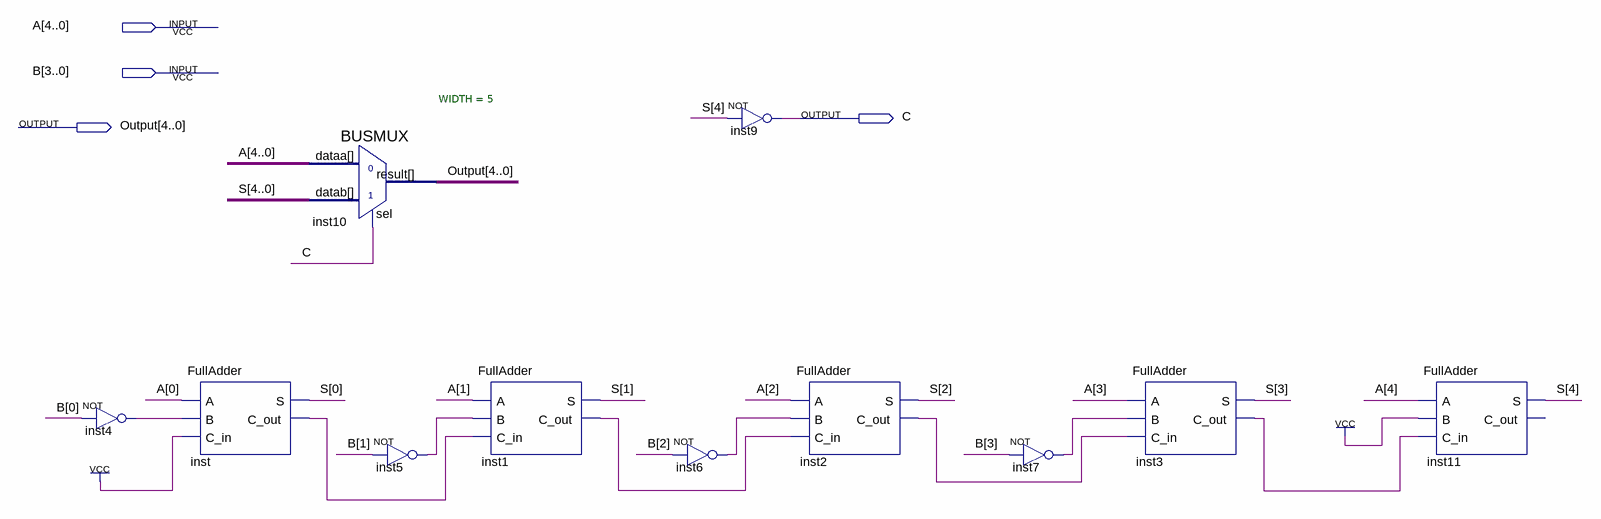
[diagram p0: schematic sheet]
// Quartus schematic Subtractor4_bit.bdf as structural Verilog: 11 symbols, 4 pins
module Subtractor4_bit (
  input  [4:0] A,
  input  [3:0] B,
  output C,
  output [4:0] Output
);

  wire inst1_c_out, inst2_c_out, inst3_c_out, inst4_out, inst5_out, inst6_out, inst7_out, inst_c_out;
  wire [4:0] S;

  not inst4 (inst4_out, B[0]);
  FullAdder inst (.A(A[0]), .B(inst4_out), .C_in(1'b1), .S(S[0]), .C_out(inst_c_out));
  BUSMUX #(.WIDTH(5)) inst10 (.datab(S), .sel(C), .dataa(A), .result(Output));
  not inst5 (inst5_out, B[1]);
  FullAdder inst1 (.A(A[1]), .B(inst5_out), .C_in(inst_c_out), .S(S[1]), .C_out(inst1_c_out));
  not inst9 (C, S[4]);
  not inst6 (inst6_out, B[2]);
  FullAdder inst2 (.A(A[2]), .B(inst6_out), .C_in(inst1_c_out), .S(S[2]), .C_out(inst2_c_out));
  not inst7 (inst7_out, B[3]);
  FullAdder inst3 (.A(A[3]), .B(inst7_out), .C_in(inst2_c_out), .S(S[3]), .C_out(inst3_c_out));
  FullAdder inst11 (.A(A[4]), .B(1'b1), .C_in(inst3_c_out), .S(S[4]));  // open: C_out
endmodule
